# Altium schematic sheet Snickerdoodle FPGA JC.SchDoc: Snickerdoodle JC
size Tabloid; ApprovedBy: NA; CompanyName: Cospan Design LLC; DrawnBy: Dave McCoy; Engineer: Dave McCoy; DocumentNumber: 7; Revision: A; SheetNumber: 7; SheetTotal: 20; Client: Public; Project: Enigma; ProjectPrettyName: Enigma
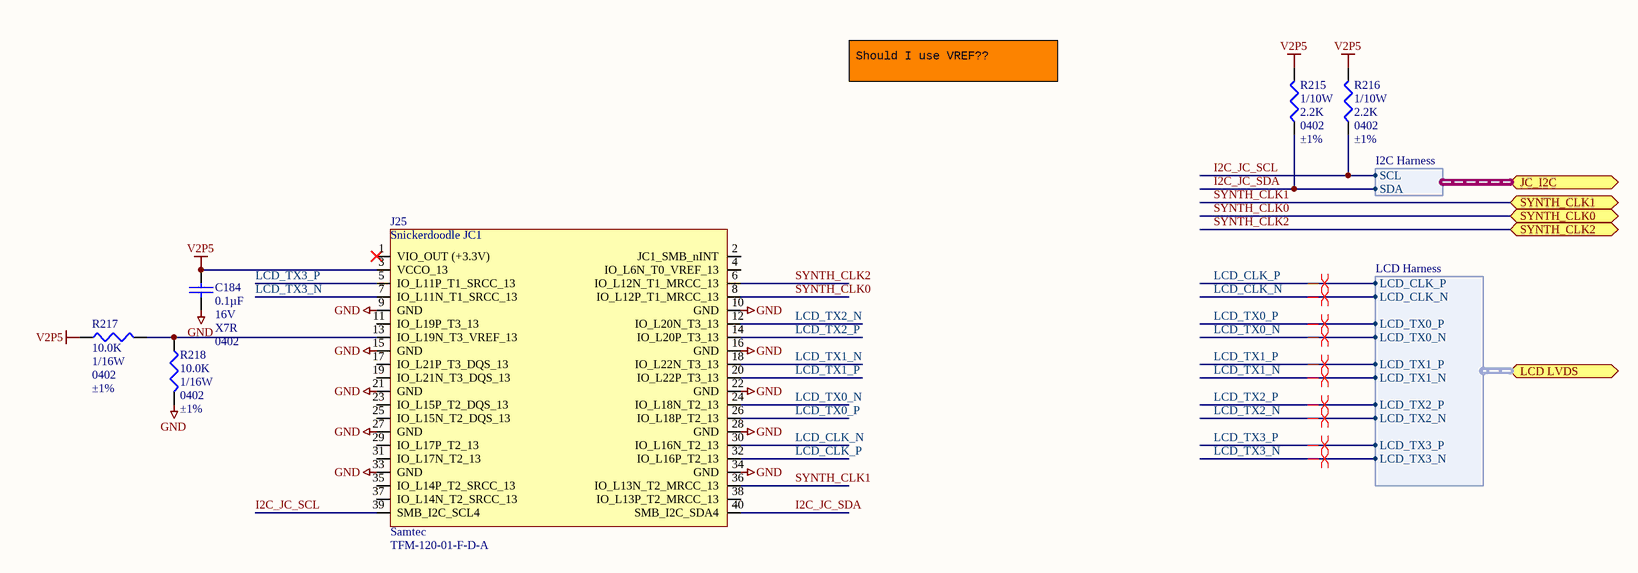
[diagram p0: Snickerdoodle FPGA JC.SchDoc]

## Parts
C184  Capacitance: 0.1µF  Voltage - Rated: 16V  Temperature Coefficient: X7R  Package / Case: 0402  [C_0402]  (hidden comment: 0.1uF)
J25  Manufacturer: Samtec  Manufacturer Part Number: TFM-120-01-F-D-A  [TFM12001-X-D-A]  (hidden comment: J_SNICKERDOODLE_JC1)
R215  Power (Watts): 1/10W  Resistance In Ohms: 2.2K  Case: 0402  Tolerance: ±1%  [R_0402]  (hidden comment: 2.2k Ohms)
R216  Power (Watts): 1/10W  Resistance In Ohms: 2.2K  Case: 0402  Tolerance: ±1%  [R_0402]  (hidden comment: 2.2k Ohms)
R217  Resistance In Ohms: 10.0K  Power (Watts): 1/16W  Case: 0402  Tolerance: ±1%  [R_0402]  (hidden comment: R_0402_10.0K)
R218  Resistance In Ohms: 10.0K  Power (Watts): 1/16W  Case: 0402  Tolerance: ±1%  [R_0402]  (hidden comment: R_0402_10.0K)

## Ports
JC_I2C (harness I2C Harness), LCD LVDS (harness LCD Harness), SYNTH_CLK0, SYNTH_CLK1, SYNTH_CLK2

## Harnesses
I2C Harness: SCL, SDA
LCD Harness: LCD_CLK_P, LCD_CLK_N, LCD_TX0_P, LCD_TX0_N, LCD_TX1_P, LCD_TX1_N, LCD_TX2_P, LCD_TX2_N, LCD_TX3_P, LCD_TX3_N

## Nets
GND: C184.1 J25.9(GND) J25.10(GND) J25.15(GND) J25.16(GND) J25.21(GND) J25.22(GND) J25.27(GND) J25.28(GND) J25.33(GND) J25.34(GND) R218.1
V2P5: C184.2 J25.3(VCCO_13) R215.1 R216.1 R217.2
I2C_JC_SCL: J25.39(SMB_I2C_SCL4) R216.2 ; port JC_I2C.SCL
I2C_JC_SDA: J25.40(SMB_I2C_SDA4) R215.2 ; port JC_I2C.SDA
LCD_CLK_N: J25.30(IO_L16N_T2_13) ; port LCD LVDS.LCD_CLK_N
LCD_CLK_P: J25.32(IO_L16P_T2_13) ; port LCD LVDS.LCD_CLK_P
LCD_TX0_N: J25.24(IO_L18N_T2_13) ; port LCD LVDS.LCD_TX0_N
LCD_TX0_P: J25.26(IO_L18P_T2_13) ; port LCD LVDS.LCD_TX0_P
LCD_TX1_N: J25.18(IO_L22N_T3_13) ; port LCD LVDS.LCD_TX1_N
LCD_TX1_P: J25.20(IO_L22P_T3_13) ; port LCD LVDS.LCD_TX1_P
LCD_TX2_N: J25.12(IO_L20N_T3_13) ; port LCD LVDS.LCD_TX2_N
LCD_TX2_P: J25.14(IO_L20P_T3_13) ; port LCD LVDS.LCD_TX2_P
LCD_TX3_N: J25.7(IO_L11N_T1_SRCC_13) ; port LCD LVDS.LCD_TX3_N
LCD_TX3_P: J25.5(IO_L11P_T1_SRCC_13) ; port LCD LVDS.LCD_TX3_P
SYNTH_CLK0: J25.8(IO_L12P_T1_MRCC_13) ; port SYNTH_CLK0
SYNTH_CLK1: J25.36(IO_L13N_T2_MRCC_13) ; port SYNTH_CLK1
SYNTH_CLK2: J25.6(IO_L12N_T1_MRCC_13) ; port SYNTH_CLK2
NetJ25_13: J25.13(IO_L19N_T3_VREF_13) R217.1 R218.2

Not connected (* = marked no-connect by the designer): J25 1(VIO_OUT_(+3.3V))* 2(JC1_SMB_nINT) 4(IO_L6N_T0_VREF_13) 11(IO_L19P_T3_13) 17(IO_L21P_T3_DQS_13) 19(IO_L21N_T3_DQS_13) 23(IO_L15P_T2_DQS_13) 25(IO_L15N_T2_DQS_13) 29(IO_L17P_T2_13) 31(IO_L17N_T2_13) 35(IO_L14P_T2_SRCC_13) 37(IO_L14N_T2_SRCC_13) 38(IO_L13P_T2_MRCC_13)

## Layout directives
differential pair: LCD_CLK_N, LCD_CLK_P, LCD_TX0_N, LCD_TX0_P, LCD_TX1_N, LCD_TX1_P, LCD_TX2_N, LCD_TX2_P, LCD_TX3_N, LCD_TX3_P

## Notes on the sheet
- Should I use VREF??
- Project:
- http://www.cospandesign.com
- Cospan Design
- Document:
- Engineer:
- Title:
- Client:
- Approved By:
- Revision:
- Date:
- Number:
- of
- (in symbol J_SNICKERDOODLE_JC1) Snickerdoodle JC1

## Library data of the parts
C184 = C_0402_0.1UF_16V: CAP CER .10UF 16V X7R 0402; Manufacturer: Murata Electronics North America; Manufacturer Part Number: GRM155R71C104KA88J; Tolerance: ±10%; Description: CAP CER 0.1UF 16V X7R 0402; Supplier 1: Digi-Key; RoHS: RoHS Compliant; Category: Capacitors; Stock 1: 18103134; Pricing 1: 1=0.1, 10=0.014, 100=0.0062, 500=0.00442, 1000=0.00348, 2500=0.00316, 5000=0.00291 (USD); Packaging: Cut Tape (CT); Part Status: Active; Operating Temperature: -55°C ~ 125°C; Features: -; Ratings: -; Applications: General Purpose; Mounting Type: Surface Mount, MLCC; Size / Dimension: 0.039" L x 0.020" W (1.00mm x 0.50mm); Height - Seated (Max): -; Thickness (Max): 0.022" (0.55mm); Lead Spacing: -; ComponentLink1URL: http://www.murata.com/~/media/webrenewal/support/library/catalog/products/capacitor/mlcc/c02e.ashx?la=en-us; ComponentLink1Description: http://www.murata.com/~/media/webrenewal/support/library/catalog/products/capacitor/mlcc/c02e.ashx?la=en-us; Supplier Part Number 1: 490-6328-1-ND
J25 = J_SNICKERDOODLE_JC1: SNICKERDOODLE JC1
R215 R216 = R_0402_2.2K: RES 2.20K OHM 1/10W 1% 0402 SMD; Manufacturer: Yageo; Manufacturer Part Number: RC0402FR-072K2L; Temperature Coefficient: ±100ppm/°C; Supplier 1: Digi-Key; Supplier Part Number 1: 311-2.20KLRCT-ND; RoHS: RoHS Compliant; Category: Resistors; Stock 1: 0; Pricing: 10=0.014, 100=0.0063, 500=0.00382, 1000=0.0027, 5000=0.00203 (USD); Resistance (Ohms): 2.2K; Composition: Thick Film; Features: -; Package / Case: 0402 (1005 Metric); Size / Dimension: 0.039" L x 0.020" W (1.00mm x 0.50mm); Height: 0.016" (0.40mm); Number of Terminations: 2; Packaging: Cut Tape (CT); ComponentLink1URL: http://www.yageo.com/documents/recent/PYu-RC0402_51_RoHS_L_6.pdf; ComponentLink1Description: http://www.yageo.com/documents/recent/PYu-RC0402_51_RoHS_L_6.pdf; Supplier 2: Digi-Key; Supplier Part Number 2: RMCF0402FT2K20CT-ND; Stock 2: 39712; ComponentLink2URL: http://www.seielect.com/Catalog/SEI-RMCF_RMCP.pdf; ComponentLink2Description: http://www.seielect.com/Catalog/SEI-RMCF_RMCP.pdf
R217 R218 = R_0402_10.0K: RES 10.0K OHM 1/16W 1% 0402 SMD; Manufacturer: Stackpole Electronics Inc; Manufacturer Part Number: RMCF0402FT10K0; Resistance (Ohms): 10k; Temperature Coefficient: ±100ppm/°C; Supplier 1: Digi-Key; Supplier Part Number 1: RMCF0402FT10K0CT-ND; RoHS: RoHS Compliant; Category: Resistors; Stock 1: 234525; Pricing: 1=0.04, 10=0.025, 50=0.0138, 100=0.0105, 250=0.0078, 500=0.00576, 1000=0.00384, 2500=0.00324, 5000=0.0027 (USD); Composition: Thick Film; Features: -; Package / Case: 0402 (1005 Metric); Size / Dimension: 0.039" L x 0.020" W (1.00mm x 0.50mm); Height: 0.016" (0.40mm); Number of Terminations: 2; Packaging: Cut Tape (CT); ComponentLink1URL: http://www.seielect.com/Catalog/SEI-RMCF_RMCP.pdf; ComponentLink1Description: http://www.seielect.com/Catalog/SEI-RMCF_RMCP.pdf